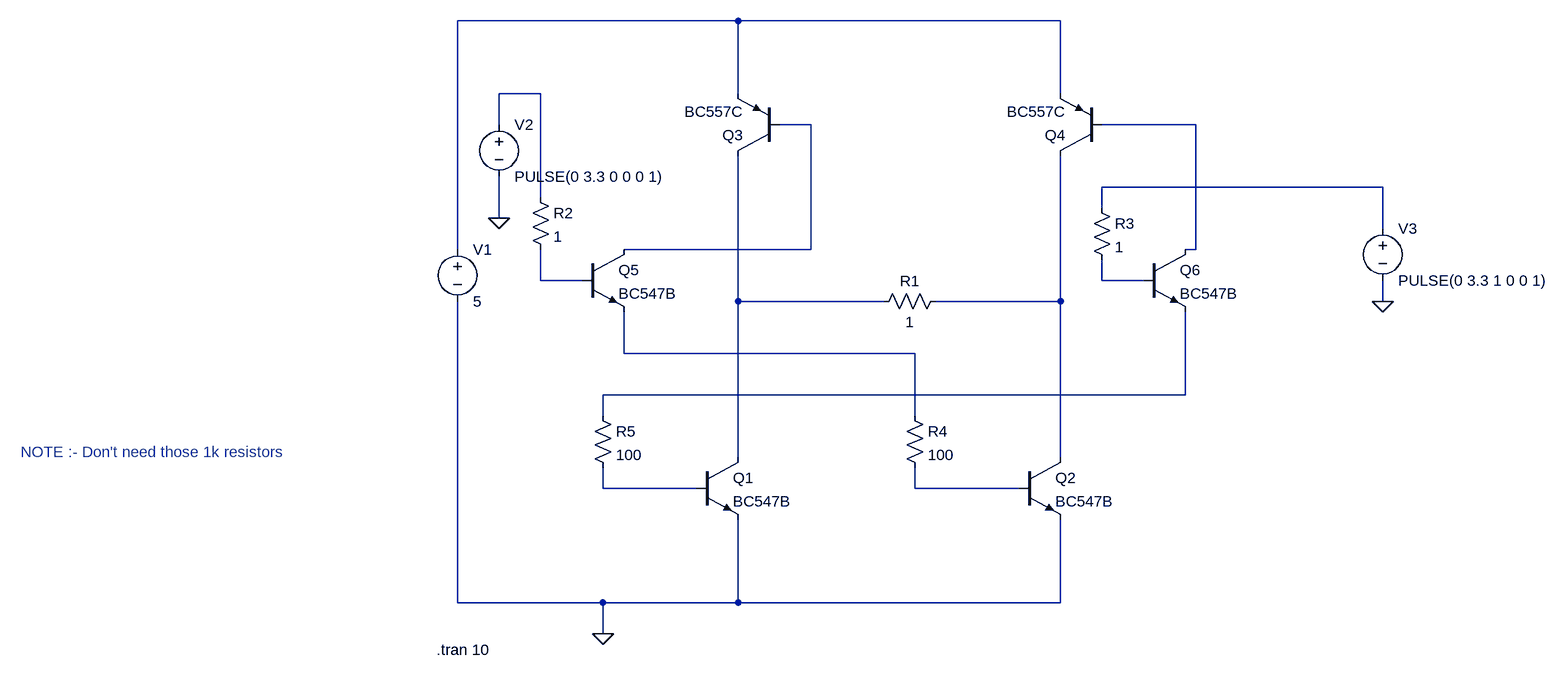
[diagram p0: schematic Two Input H-Bridge.asc]
Two Input H-Bridge.asc, the LTspice schematic file:
Version 4
SHEET 1 1548 680
WIRE 288 -464 -144 -464
WIRE 784 -464 288 -464
WIRE -16 -352 -80 -352
WIRE 288 -352 288 -464
WIRE 784 -352 784 -464
WIRE -80 -304 -80 -352
WIRE 400 -304 352 -304
WIRE 992 -304 848 -304
WIRE 1280 -208 848 -208
WIRE -16 -192 -16 -352
WIRE 848 -176 848 -208
WIRE -80 -160 -80 -224
WIRE 1280 -144 1280 -208
WIRE -144 -112 -144 -464
WIRE 400 -112 400 -304
WIRE 400 -112 112 -112
WIRE 992 -112 992 -304
WIRE 992 -112 976 -112
WIRE -16 -64 -16 -112
WIRE 48 -64 -16 -64
WIRE 848 -64 848 -96
WIRE 912 -64 848 -64
WIRE 288 -32 288 -256
WIRE 512 -32 288 -32
WIRE 784 -32 784 -256
WIRE 784 -32 592 -32
WIRE 1280 -32 1280 -64
WIRE 112 48 112 -16
WIRE 560 48 112 48
WIRE 976 112 976 -16
WIRE 976 112 80 112
WIRE 80 144 80 112
WIRE 560 144 560 48
WIRE 288 208 288 -32
WIRE 784 208 784 -32
WIRE 80 256 80 224
WIRE 224 256 80 256
WIRE 560 256 560 224
WIRE 720 256 560 256
WIRE -144 432 -144 -32
WIRE 80 432 -144 432
WIRE 288 432 288 304
WIRE 288 432 80 432
WIRE 784 432 784 304
WIRE 784 432 288 432
WIRE 80 480 80 432
FLAG 80 480 0
FLAG -80 -160 0
FLAG 1280 -32 0
SYMBOL npn 224 208 R0
SYMATTR InstName Q1
SYMATTR Value BC547B
SYMBOL npn 720 208 R0
SYMATTR InstName Q2
SYMATTR Value BC547B
SYMBOL pnp 352 -256 R180
SYMATTR InstName Q3
SYMATTR Value BC557C
SYMBOL pnp 848 -256 R180
SYMATTR InstName Q4
SYMATTR Value BC557C
SYMBOL res 608 -48 R90
WINDOW 0 0 56 VBottom 2
WINDOW 3 32 56 VTop 2
SYMATTR InstName R1
SYMATTR Value 1
SYMBOL voltage -144 -128 R0
SYMATTR InstName V1
SYMATTR Value 5
SYMBOL npn 48 -112 R0
SYMATTR InstName Q5
SYMATTR Value BC547B
SYMBOL npn 912 -112 R0
SYMATTR InstName Q6
SYMATTR Value BC547B
SYMBOL res -32 -208 R0
SYMATTR InstName R2
SYMATTR Value 1
SYMBOL res 832 -192 R0
SYMATTR InstName R3
SYMATTR Value 1
SYMBOL voltage -80 -320 R0
WINDOW 123 0 0 Left 0
WINDOW 39 0 0 Left 0
SYMATTR InstName V2
SYMATTR Value PULSE(0 3.3 0 0 0 1)
SYMBOL voltage 1280 -160 R0
WINDOW 123 0 0 Left 0
WINDOW 39 0 0 Left 0
SYMATTR InstName V3
SYMATTR Value PULSE(0 3.3 1 0 0 1)
SYMBOL res 544 128 R0
SYMATTR InstName R4
SYMATTR Value 100
SYMBOL res 64 128 R0
SYMATTR InstName R5
SYMATTR Value 100
TEXT -176 504 Left 2 !.tran 10
TEXT -816 200 Left 2 ;NOTE :- Don't need those 1k resistors

The netlist it stands for:
* Two Input H-Bridge.asc
Q1 N008 N012 0 0 BC547B
Q2 N009 N013 0 0 BC547B
Q3 N008 N003 N001 0 BC557C
Q4 N009 N004 N001 0 BC557C
R1 N009 N008 1
V1 N001 0 5
Q5 N003 N006 N010 0 BC547B
Q6 N004 N007 N011 0 BC547B
R2 N002 N006 1
R3 N005 N007 1
V2 N002 0 PULSE(0 3.3 0 0 0 1)
V3 N005 0 PULSE(0 3.3 1 0 0 1)
R4 N010 N013 100
R5 N011 N012 100
.model NPN NPN
.model PNP PNP
.lib standard.bjt
.tran 10
* NOTE :- Don't need those 1k resistors
.backanno
.end